# EAGLE design 12db-Xover (EAGLE 7.6.0)
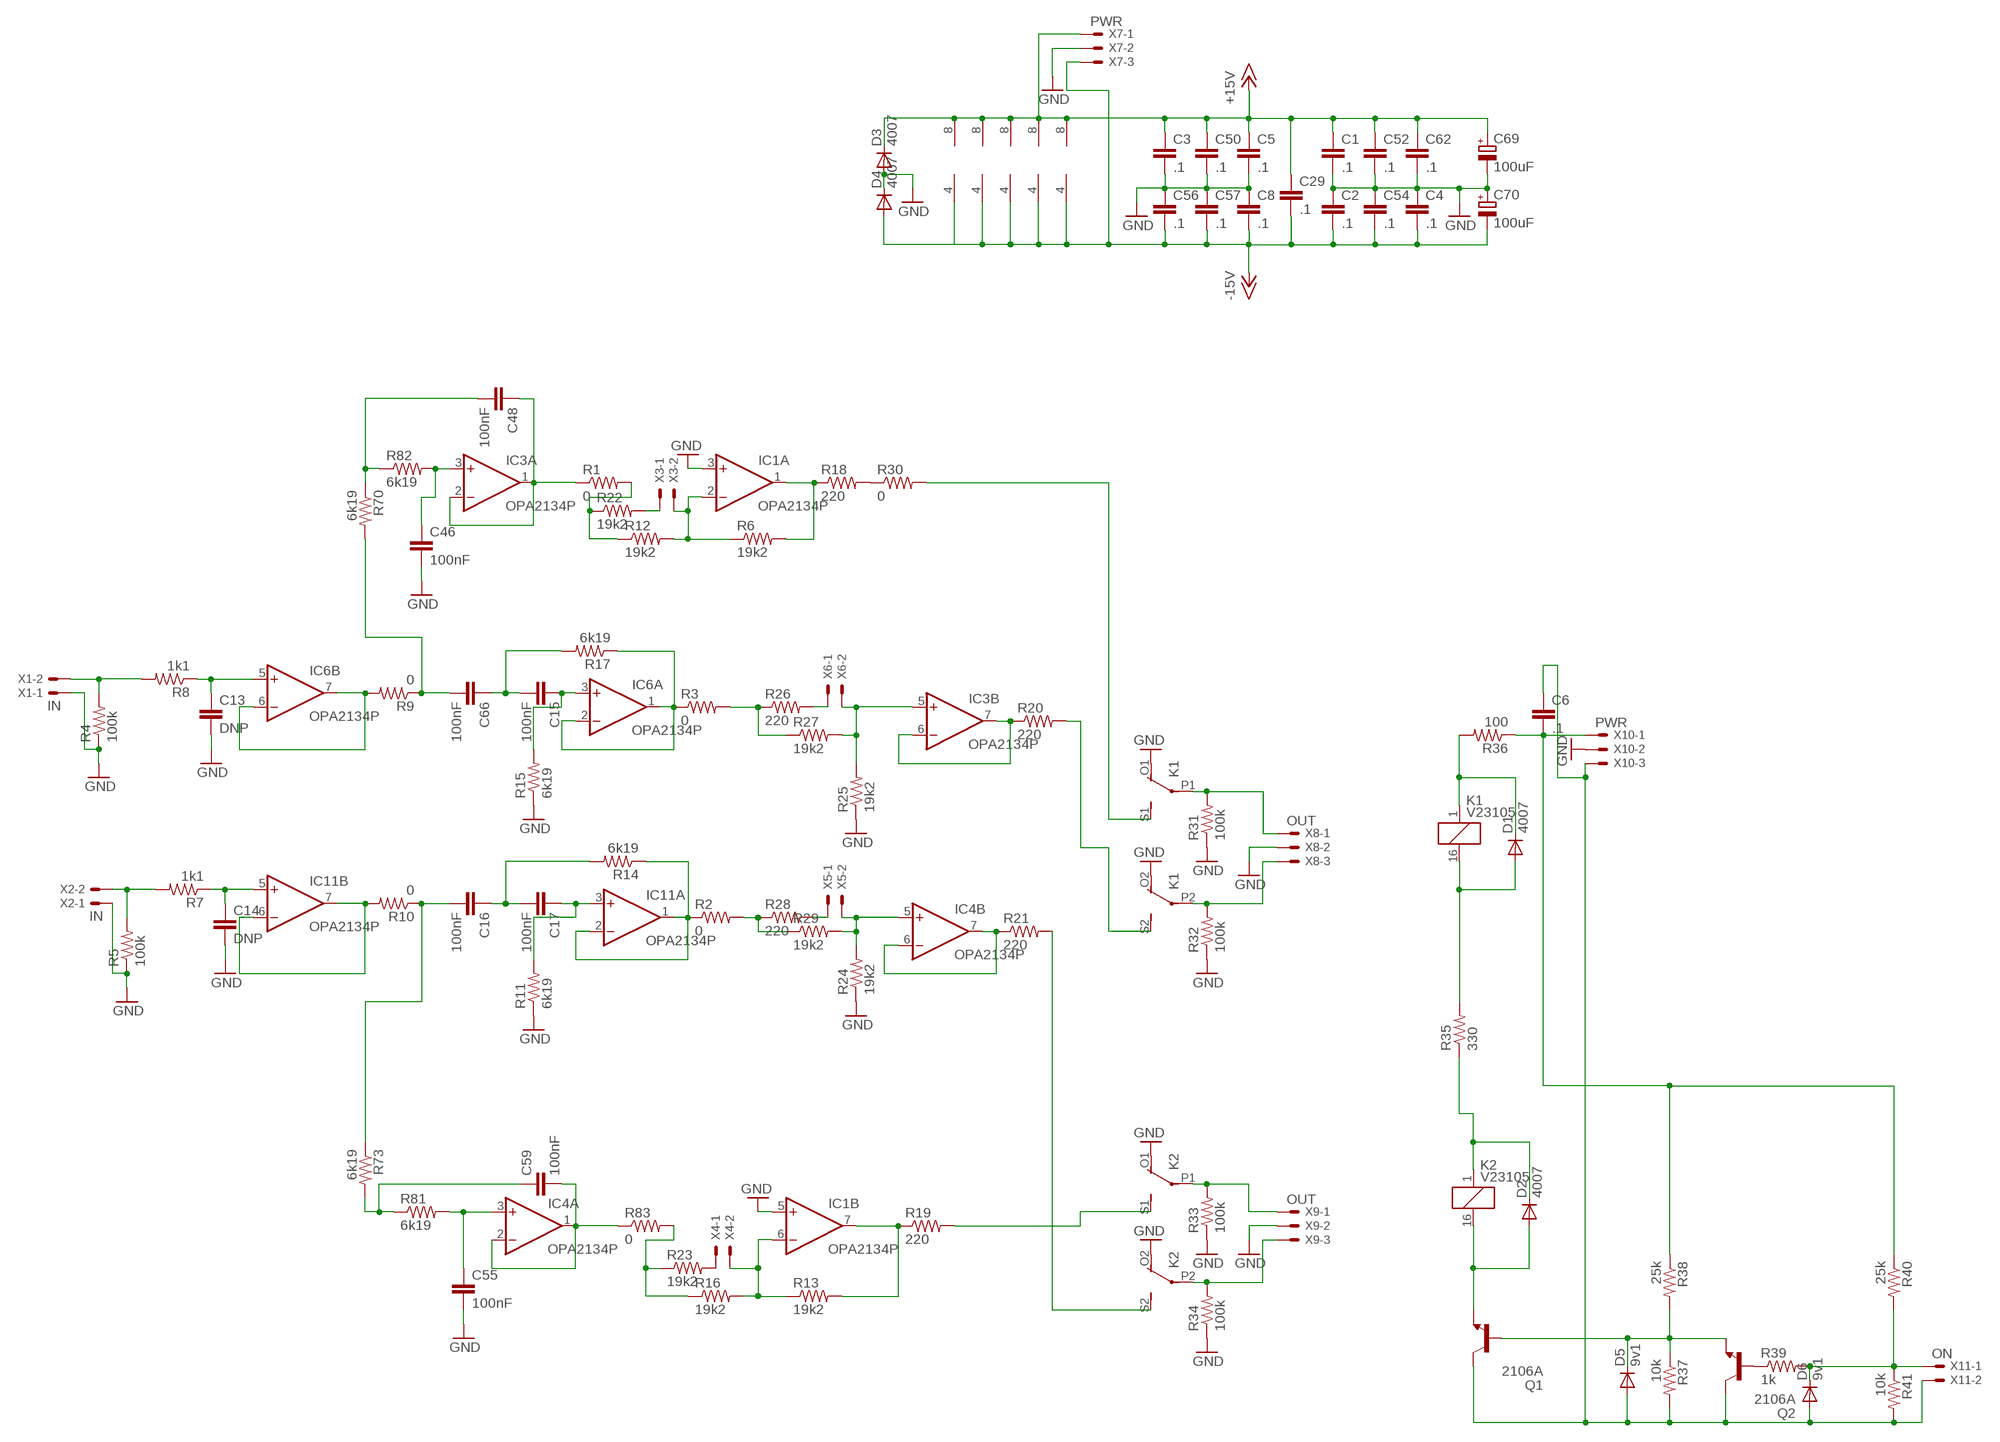
[diagram p0: schematic, sheet 1]

## Parts
C1  .1  C-EUC4532  [C4532]
C2  .1  C-EUC4532  [C4532]
C3  .1  C-EUC4532  [C4532]
C4  .1  C-EUC4532  [C4532]
C5  .1  C-EUC4532  [C4532]
C6  .1  C-EUC4532  [C4532]
C8  .1  C-EUC4532  [C4532]
C13  DNP  C-EU050-035X075  [C050-035X075]
C14  DNP  C-EU050-035X075  [C050-035X075]
C15  100nF  C-EU050-075X075  [C050-075X075]
C16  100nF  C-EU050-075X075  [C050-075X075]
C17  100nF  C-EU050-075X075  [C050-075X075]
C29  .1  C-EUC4532  [C4532]
C46  100nF  C-EU050-075X075  [C050-075X075]
C48  100nF  C-EU050-075X075  [C050-075X075]
C50  .1  C-EUC4532  [C4532]
C52  .1  C-EUC4532  [C4532]
C54  .1  C-EUC4532  [C4532]
C55  100nF  C-EU050-075X075  [C050-075X075]
C56  .1  C-EUC4532  [C4532]
C57  .1  C-EUC4532  [C4532]
C59  100nF  C-EU050-075X075  [C050-075X075]
C62  .1  C-EUC4532  [C4532]
C66  100nF  C-EU050-075X075  [C050-075X075]
C69  100uF  CPOL-EUE3.5-10  [E3,5-10]
C70  100uF  CPOL-EUE3.5-10  [E3,5-10]
D1  4007  1N4148DO35-10  [DO35-10]
D2  4007  1N4148DO35-10  [DO35-10]
D3  4007  1N4148DO35-10  [DO35-10]
D4  4007  1N4148DO35-10  [DO35-10]
D5  9v1  1N4148DO35-7  [DO35-7]
D6  9v1  1N4148DO35-7  [DO35-7]
IC1  OPA2134P  [DIL08]
IC3  OPA2134P  [DIL08]
IC4  OPA2134P  [DIL08]
IC6  OPA2134P  [DIL08]
IC11  OPA2134P  [DIL08]
K1  V23105  351  [351]
K2  V23105  351  [351]
Q1  2106A  BC546B  [TO92-EBC]
Q2  2106A  BC546B  [TO92-EBC]
R1  0  R-US_0309/12  [0309/12]
R2  0  R-US_0309/10  [0309/10]
R3  0  R-US_0309/12  [0309/12]
R4  100k  R-US_0309/10  [0309/10]
R5  100k  R-US_0309/10  [0309/10]
R6  19k2  R-US_0309/10  [0309/10]
R7  1k1  R-US_0309/10  [0309/10]
R8  1k1  R-US_0309/10  [0309/10]
R9  0  R-US_0309/10  [0309/10]
R10  0  R-US_0309/10  [0309/10]
R11  6k19  R-US_0309/12  [0309/12]
R12  19k2  R-US_0309/10  [0309/10]
R13  19k2  R-US_0309/10  [0309/10]
R14  6k19  R-US_0309/10  [0309/10]
R15  6k19  R-US_0309/12  [0309/12]
R16  19k2  R-US_0309/10  [0309/10]
R17  6k19  R-US_0309/10  [0309/10]
R18  220  R-US_0309/12  [0309/12]
R19  220  R-US_0309/10  [0309/10]
R20  220  R-US_0309/12  [0309/12]
R21  220  R-US_0309/10  [0309/10]
R22  19k2  R-US_0309/10  [0309/10]
R23  19k2  R-US_0309/10  [0309/10]
R24  19k2  R-US_0309/12  [0309/12]
R25  19k2  R-US_0309/12  [0309/12]
R26  220  R-US_0309/10  [0309/10]
R27  19k2  R-US_0309/10  [0309/10]
R28  220  R-US_0309/10  [0309/10]
R29  19k2  R-US_0309/10  [0309/10]
R30  0  R-US_0309/10  [0309/10]
R31  100k  R-US_0309/10  [0309/10]
R32  100k  R-US_0309/10  [0309/10]
R33  100k  R-US_0309/10  [0309/10]
R34  100k  R-US_0309/10  [0309/10]
R35  330  R-US_0411/15  [0411/15]
R36  100  R-US_0309/12  [0309/12]
R37  10k  R-US_0309/12  [0309/12]
R38  25k  R-US_0309/10  [0309/10]
R39  1k  R-US_0309/10  [0309/10]
R40  25k  R-US_0309/10  [0309/10]
R41  10k  R-US_0309/12  [0309/12]
R70  6k19  R-US_0309/12  [0309/12]
R73  6k19  R-US_0309/12  [0309/12]
R81  6k19  R-US_0309/12  [0309/12]
R82  6k19  R-US_0309/12  [0309/12]
R83  0  R-US_0309/10  [0309/10]
X1  IN  22-23-2021  [22-23-2021]
X2  IN  22-23-2021  [22-23-2021]
X3  22-23-2021  [22-23-2021]
X4  22-23-2021  [22-23-2021]
X5  22-23-2021  [22-23-2021]
X6  22-23-2021  [22-23-2021]
X7  PWR  22-23-2031  [22-23-2031]
X8  OUT  22-23-2031  [22-23-2031]
X9  OUT  22-23-2031  [22-23-2031]
X10  PWR  22-23-2031  [22-23-2031]
X11  ON  22-23-2021  [22-23-2021]

## Nets
+15V: C1.1 C3.1 C5.1 C29.1 C50.1 C52.1 C62.1 C69.+ D3.C IC1.8(P:V+) IC3.8(P:V+) IC4.8(P:V+) IC6.8(P:V+) IC11.8(P:V+) X7.1
-15V: C2.2 C4.2 C8.2 C29.2 C54.2 C56.2 C57.2 C70.- D4.A IC1.4(P:V-) IC3.4(P:V-) IC4.4(P:V-) IC6.4(P:V-) IC11.4(P:V-) X7.3
GND: C1.2 C2.1 C3.2 C4.1 C5.2 C8.1 C13.2 C14.2 C46.2 C50.2 C52.2 C54.1 C55.2 C56.1 C57.1 C62.2 C69.- C70.+ D3.A D4.C IC1.3(A:+IN) IC1.5(B:+IN) K1.O1(2:O) K1.O2(3:O) K2.O1(2:O) K2.O2(3:O) R4.1 R5.1 R11.1 R15.1 R24.1 R25.1 R31.1 R32.1 R33.1 R34.1 X1.1 X2.1 X7.2 X8.2 X9.2 X10.2
N$1: IC6.1(A:OUT) IC6.2(A:-IN) R3.1 R17.1
N$2: IC3.5(B:+IN) R25.2 R27.2 X6.2
N$3: IC11.6(B:-IN) IC11.7(B:OUT) R10.2
N$4: IC4.5(B:+IN) R24.2 R29.2 X5.2
N$5: C14.1 IC11.5(B:+IN) R7.1
N$6: R5.2 R7.2 X2.2
N$7: R4.2 R8.2 X1.2
N$8: C13.1 IC6.5(B:+IN) R8.1
N$9: IC6.6(B:-IN) IC6.7(B:OUT) R9.2
N$10: IC1.2(A:-IN) R6.1 R12.2 X3.2
N$11: IC1.6(B:-IN) R13.1 R16.2 X4.2
N$12: C15.1 IC6.3(A:+IN) R15.2
N$13: C15.2 C66.1 R17.2
N$14: IC1.1(A:OUT) R6.2 R18.1
N$15: C16.1 C17.2 R14.2
N$16: C17.1 IC11.3(A:+IN) R11.2
N$17: IC3.6(B:-IN) IC3.7(B:OUT) R20.1
N$18: IC4.6(B:-IN) IC4.7(B:OUT) R21.1
N$19: IC1.7(B:OUT) R13.2 R19.1
N$20: R22.2 X3.1
N$21: R1.2 R12.1 R22.1
N$22: R16.1 R23.1 R83.2
N$23: R23.2 X4.1
N$24: R26.2 X6.1
N$25: R28.2 X5.1
N$26: R3.2 R26.1 R27.1
N$27: R2.2 R28.1 R29.1
N$28: IC11.1(A:OUT) IC11.2(A:-IN) R2.1 R14.1
N$29: R18.2 R30.1
N$30: K2.P2(3:P) R34.2 X9.3
N$31: K2.P1(2:P) R33.2 X9.1
N$32: K1.P2(3:P) R32.2 X8.3
N$33: K1.P1(2:P) R31.2 X8.1
N$34: K1.S1(2:S) R30.2
N$35: K1.S2(3:S) R20.2
N$36: K2.S1(2:S) R19.2
N$37: K2.S2(3:S) R21.2
N$38: D2.C K2.1 R35.1
N$39: D1.A K1.16 R35.2
N$40: D1.C K1.1 R36.2
N$41: D2.A K2.16 Q1.E
N$42: C6.2 R36.1 R38.1 R40.1 X10.1
N$43: C6.1 D5.A D6.A Q1.C Q2.C R37.2 R41.2 X10.3 X11.2
N$44: D5.C Q1.B Q2.E R37.1 R38.2
N$45: Q2.B R39.1
N$46: D6.C R39.2 R40.2 R41.1 X11.1
N$76: C66.2 R9.1 R70.2
N$85: C59.2 IC4.1(A:OUT) IC4.2(A:-IN) R83.1
N$86: C48.1 IC3.1(A:OUT) IC3.2(A:-IN) R1.1
N$89: C46.1 IC3.3(A:+IN) R82.2
N$90: C48.2 R70.1 R82.1
N$91: C59.1 R73.2 R81.1
N$92: C55.1 IC4.3(A:+IN) R81.2
N$102: C16.2 R10.1 R73.1

## Library data of the parts
C1-C6 C8 C13-C17 C29 C46 C48 C50 C52 C54-C57 C59 C62 C66 = resistor:C-EU: CAPACITOR, European symbol
C69 C70 = resistor:CPOL-EU: POLARIZED CAPACITOR, European symbol
D1-D6 = diode:1N4148: DIODE high speed (Philips)
IC1 IC3 IC4 IC6 IC11 = linear:OPA2134: SoundPLUS (TM) High Performance AUDIO OPERATIONAL AMPLIFIERS Source: http://focus.ti.com/lit/ds/sbos058/sbos058.pdf
K1 K2 = relay:351: RELAY 2 x switch, Omron; OC_FARNELL: unknown; OC_NEWARK: unknown
Q1 Q2 = transistor-npn:BC546*: NPN Transistor
R1-R41 R70 R73 R81-R83 = resistor:R-US_: RESISTOR, American symbol
X1-X6 X11 = con-molex:22-23-2021: .100" (2.54mm) Center Header - 2 Pin; MF: MOLEX; MPN: 22-23-2021; OC_FARNELL: 1462926; OC_NEWARK: 25C3832
X7-X10 = con-molex:22-23-2031: .100" (2.54mm) Center Header - 3 Pin; MF: MOLEX; MPN: 22-23-2031; OC_FARNELL: 1462950; OC_NEWARK: 30C0862

## Board
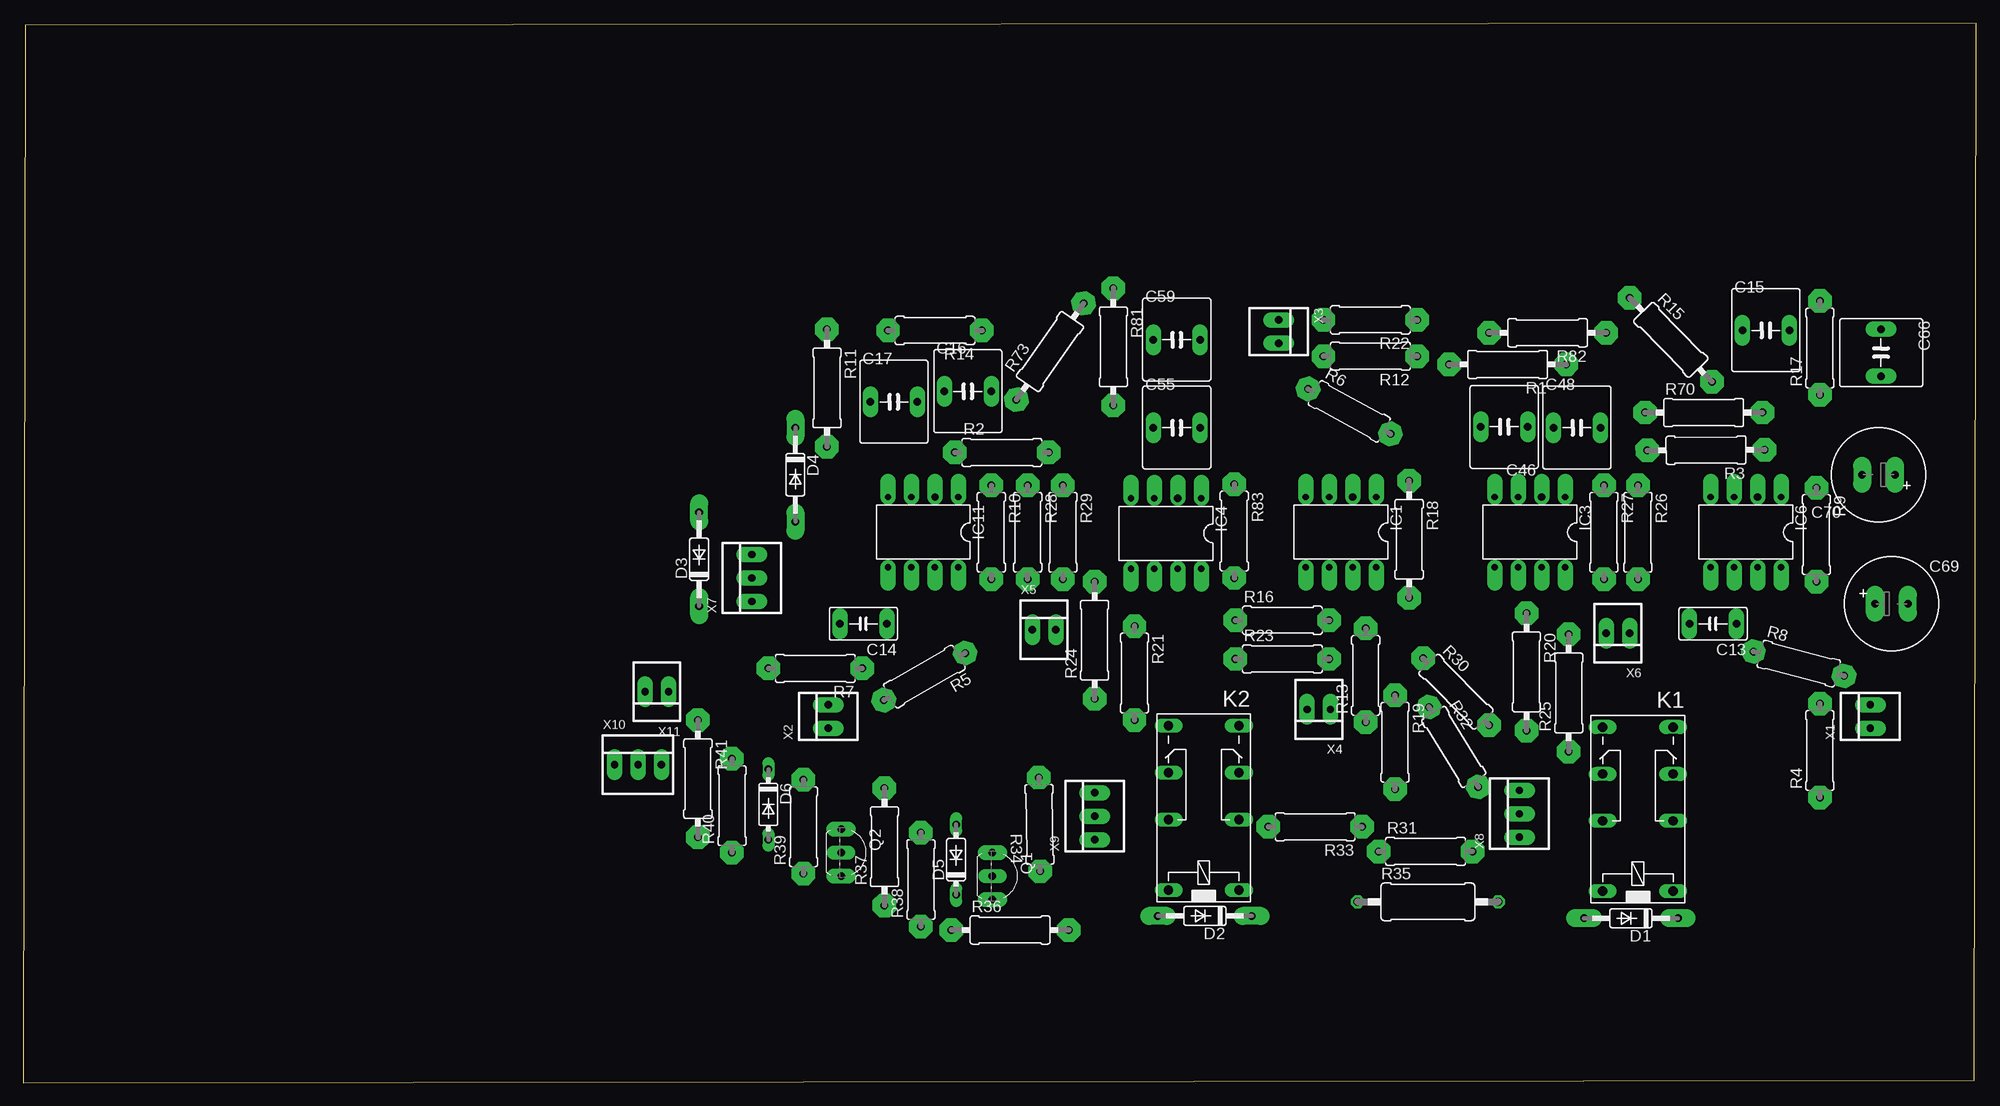
[diagram p1: board, top side]
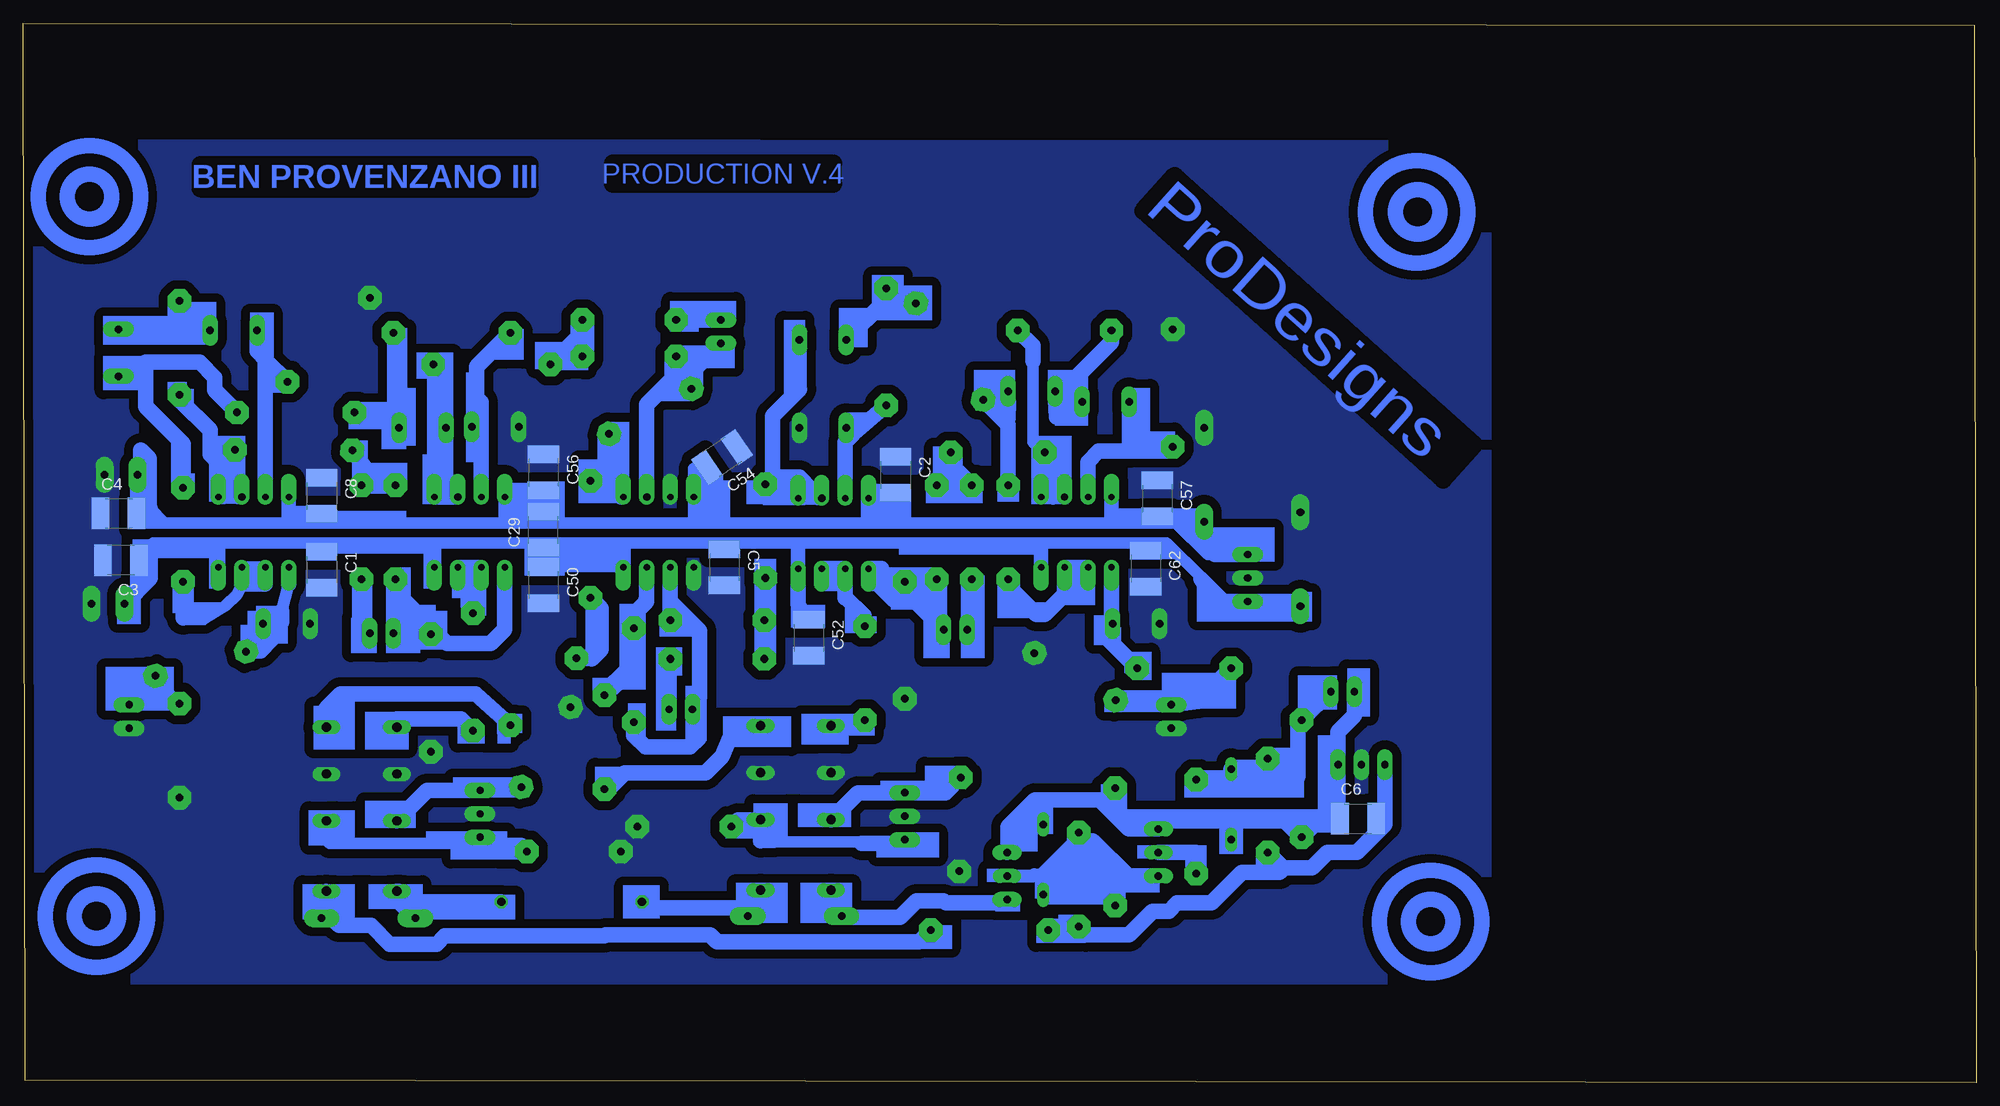
[diagram p2: board, bottom side, seen from below]

Size 211.38 x 114.67 mm. Coordinates in mm from the lower left corner, seen from the top.
Outline: 0,0 211.12,0.25 211.38,114.67 0.25,114.42 0,0
Copper layers (1*16): Top 0.035mm / dielectric 1.5mm / Bottom 0.035mm
Design rules "default": minimum track width 10mil, minimum drill 24mil, track to track 8mil, track to pad 8mil, pad to pad 8mil, via to via 8mil, smd to smd 8mil, copper to edge 40mil, drill to drill 8mil, minimum pad ring 10mil, minimum via ring 8mil, stop-mask expansion 5mil, vias tented up to drill 0mil, thermal gap 10mil

### Footprints (pad centres in the part's own frame; a part is rotated, then mirrored left to right if it is on the bottom)
C4532 = smd 1.9 x 3.4: 1 -1.95,0; 2 1.95,0
C050-035X075 = drill 0.813 pad 1.676 long: 1 -2.54,0; 2 2.54,0
C050-075X075 = drill 0.813 pad 1.676 long: 1 -2.54,0; 2 2.54,0
E3,5-10 = drill 0.813 pad 1.93 long: + -1.778,0; - 1.778,0
DO35-10 = drill 0.813 pad 1.93 long: A 5.08,0; C -5.08,0
DO35-7 = drill 0.813 long: A 3.81,0; C -3.81,0
DIL08 = drill 0.7 pad 1.676 offset: 1 -3.81,-3.81; 3 1.27,-3.81; 4 3.81,-3.81; 5 3.81,3.81; 6 1.27,3.81; 7 -1.27,3.81; 8 -3.81,3.81 | drill 0.8 pad 1.676 offset: 2 -1.27,-3.81
351 = drill 1.016 long: 1 -3.81,-3.81; 16 -3.81,3.81; O1 8.89,-3.81; O2 8.89,3.81; P1 3.81,-3.81; P2 3.81,3.81; S1 13.97,-3.81; S2 13.97,3.81
TO92-EBC = drill 0.813 pad 1.524 long: B 0,-1.27 | drill 0.813 pad 1.6 long: C -2.54,-1.27; E 2.54,-1.27
0309/12 = drill 0.813 pad 2.54 octagon: 1 -6.35,0; 2 6.35,0
0309/10 = drill 0.813 pad 2.54 octagon: 1 -5.08,0; 2 5.08,0
0411/15 = drill 0.914 octagon: 1 -7.62,0; 2 7.62,0
22-23-2021 = drill 0.8 pad 1.676 long: 1 -1.27,0; 2 1.27,0
22-23-2031 = drill 0.8 pad 1.676 long: 1 -2.54,0; 2 0,0; 3 2.54,0

### Placement (x,y rotation side)
C1  179.07,55.5 270 bottom
C2  116.97,65.79 270 bottom
C3  200.79,56.52 180 bottom
C4  201.04,61.59 0 bottom
C5  135.51,55.75 270.2 bottom
C6  66.93,28.57 0 bottom
C8  179.07,63.5 270 bottom
C13  182.88,49.66 180 top
C14  90.93,49.66 180 top
C15  188.59,81.41 0 top
C16  102.23,74.8 0 top
C17  94.23,73.66 0 top
C29  155.07,59.82 90 bottom
C46  160.27,70.99 180 top
C48  168.15,70.87 0 top
C50  155.07,53.85 270 bottom
C52  126.37,48.13 270 bottom
C54  135.76,67.69 214.4 bottom
C55  124.84,70.87 0 top
C56  155.07,66.04 270 bottom
C57  88.65,63.25 270 bottom
C59  124.84,80.39 0 top
C62  89.92,55.63 270 bottom
C66  201.04,78.99 270 top
C69  202.18,51.82 0 top
C70  200.79,65.79 180 top
D1  173.99,17.78 180 top
D2  127.89,18.03 180 top
D3  73.15,56.64 90 top
D4  83.57,65.79 270 top
D5  100.97,24.13 90 top
D6  80.64,30.1 270 top
IC1  142.62,59.56 180 top
IC3  163.07,59.56 180 top
IC4  123.7,59.44 180 top
IC6  186.44,59.56 180 top
IC11  97.41,59.56 180 top
K1  174.75,24.51 90 top
K2  127.76,24.64 90 top
Q1  106.17,22.35 270 top
Q2  89.79,24.89 270 top
R1  160.66,77.72 180 top
R2  105.92,68.2 0 top
R3  182.12,68.45 180.3 top
R4  194.44,35.94 90 top
R5  97.54,43.94 210.1 top
R6  143.51,72.64 331.3 top
R7  85.72,44.83 180 top
R8  192.15,45.34 345 top
R9  194.06,59.31 270 top
R10  104.78,59.56 270 top
R11  87,75.18 270 top
R12  145.8,78.61 180 top
R13  145.29,44.07 90 top
R14  98.68,81.41 180 top
R15  178.31,80.39 314.5 top
R16  136.27,50.04 0 top
R17  194.44,79.5 90 top
R18  149.99,58.8 270 top
R19  148.46,36.83 270 top
R20  162.69,44.45 270 top
R21  120.27,44.32 270 top
R22  145.8,82.55 180 top
R23  136.27,45.85 0 top
R24  115.95,47.88 90 top
R25  167.26,42.16 90 top
R26  174.75,59.56 270 top
R27  171.07,59.56 270 top
R28  108.71,59.56 270 top
R29  112.52,59.56 270 top
R30  155.07,42.29 314.6 top
R31  151.76,25.02 0 top
R32  154.81,36.32 301.6 top
R33  139.83,27.69 180 top
R34  109.98,27.94 90.8 top
R35  152.02,19.56 0 top
R36  106.81,16.51 0 top
R37  93.22,25.53 90 top
R38  97.16,21.97 90 top
R39  84.46,27.69 90 top
R40  76.71,29.97 90 top
R41  73.03,32.89 270 top
R70  181.86,72.52 0 top
R73  111.12,79.12 55.1 top
R81  117.98,79.63 270 top
R82  164.97,81.15 180 top
R83  131.06,59.69 270 top
X1  199.9,39.62 90 top
X2  87.12,39.62 90 top
X3  135.89,81.28 270 top
X4  140.21,40.39 180 top
X5  110.49,49.02 0 top
X6  172.59,48.64 180 top
X7  78.87,54.61 90 top
X8  161.92,29.08 90 top
X9  115.95,28.83 90 top
X10  66.55,34.42 0 top
X11  68.58,42.29 180 top

### Tracks (layer width: path | path; a pad name or v marks a point on that pad's centre or on a via)
+15V
  Bottom 0.406: IC6.8 190.25,58.42
  Bottom 1.016: IC3.8 166.88,58.29 | 87.29,57.58 88.01,57.78 88.01,58.42 | IC11.8 101.22,58.29
  Bottom 1.27: 127.63,58.42 135.13,58.42 | 135.13,58.42 146.43,58.42 | 146.43,58.42 167,58.42 | 167,58.42 179.07,58.42 | 179.07,58.42 190.25,58.42 197.28,58.42 197.89,57.66 | 166.88,58.29 167,58.42 | 127.63,58.42 127.51,58.29 IC4.8 | 101.22,58.29 101.09,58.42 | 127.63,58.42 101.09,58.42 | 101.09,58.42 88.01,58.42 87.63,58.42 83.82,54.61 83.8,54.35 | 146.43,57.78 146.43,58.42 | C5.1 135.13,58.09 135.13,58.42 | C1.1 179.07,58.42
  Bottom 1.676: C52.1 127.51,51.73 IC4.8 | 87.29,57.58 C62.1 | 197.61,57.28 197.89,57.56 197.89,57.66 | 197.61,57.28 197.61,54.61 C69.+ 200.03,51.82 199.64,51.44 | C50.1 C29.1 148.29,57.87 IC1.8 146.43,57.78 | 197.61,57.28 197.82,57.28 C3.1 | 83.94,54.48 83.8,54.35 81.53,52.07 X7.1 73.66,52.07 D3.C
-15V
  Bottom 0.406: 182.63,63.25 182.55,61.57 182.5,60.58
  Bottom 1.016: IC11.4 93.6,60.71
  Bottom 1.27: 88.65,60.58 86.61,60.58 83.19,57.15 82.42,57.15 81.91,57.15 | 88.65,60.58 93.47,60.58 | 93.47,60.58 118.36,60.58 | 118.36,60.58 138.81,60.58 | 138.81,60.58 159.13,60.58 | 159.13,60.58 182.5,60.58 196.09,60.58 197.61,62.1 | 159.26,60.71 159.13,60.58 | 93.6,60.71 93.47,60.58 | C57.2 88.65,60.58 | 118.36,60.58 118.24,60.71 118.24,61.47 | 138.81,60.58 IC1.4 138.81,66.47 C54.2
  Bottom 1.422: C70.- 197.61,66.42 197.61,62.1 | IC3.4 159.26,60.71
  Bottom 1.676: IC4.4 119.89,62.61 | 119.89,62.61 119.89,61.21 118.92,62.19 C2.2 | 182.63,63.25 IC6.4 182.63,64.52 | 197.61,62.1 199.09,62.1 C4.2 | C56.2 C29.2 155.07,61.72 155.57,61.21 156.84,61.21 IC3.4 | 179.07,61.59 C8.2 179.09,61.57 182.55,61.57 | C70.- 197.87,65.79 197.74,65.91 197.74,67.56 198.63,68.45 198.63,66.17 C70.- | C70.- 199.01,65.66 | D4.A 83.57,58.29 82.42,57.15 X7.3 | 118.24,61.47 118.75,61.47 119.89,62.61
GND
  pour Bottom (isolate 0.965, no thermals): 53.21,101.35 53.21,11.3 209.93,11.3 210.06,101.47
N$1
  Bottom 1.676: IC6.2 188.85,63.5 | 188.85,63.5 IC6.1 | 190.31,67.12 191.13,67.94 191.13,70.61 194.31,73.79 R17.1 | 190.31,67.12 188.85,65.66 188.85,63.5 | R3.1 190.31,67.65 190.31,67.12
N$2
  Bottom 1.676: IC3.5 159.26,49.02 160.78,47.5 165.48,47.5 168.02,50.04 | 168.02,50.04 168.47,50.48 | 168.47,50.48 171.07,53.09 R27.2 | X6.2 169.48,50.48 168.47,50.48 | R25.2 167.64,50.04 168.02,50.04
N$3
  Bottom 1.676: R10.2 104.78,53.72 101.73,50.67 100.84,50.67 98.68,52.83 IC11.7 IC11.6
N$4
  Bottom 1.676: 118.49,55.63 118.75,55.63 | 118.75,55.63 IC4.5 | R24.2 114.94,52.2 | 114.94,52.2 112.65,54.48 R29.2 | X5.2 114.94,52.2 | 114.94,52.2 117.09,52.2 118.75,53.85 118.75,55.63
N$5
  Bottom 1.676: IC11.5 93.6,50.67 C14.1 93.6,49.66 94.23,49.02 94.23,48.26 R7.1
N$6
  Bottom 1.676: R7.2 84.2,41.27 X2.2 90.68,41.27 90.8,41.39 R5.2
N$7
  Bottom 1.676: R8.2 197.23,44.2 199.01,44.2 | 199.01,44.2 R4.2 | X1.2 199.01,41.78 199.01,44.2
N$8
  Bottom 1.27: 182.63,53.98 183.39,51.05
  Bottom 1.676: IC6.5 182.63,53.98 | 184.53,49.28 184.7,49.19 184.96,49.19 C13.1 | 184.53,49.28 183.39,49.88 183.39,51.05 | R8.1 187.16,46.74 185.67,46.74 184.53,47.88 184.53,49.28
N$9
  Bottom 1.016: 191.77,50.16 193.93,50.16 194.06,50.29
  Bottom 1.27: IC6.6 185.17,53.98 | IC6.7 187.71,55.37 187.71,53.85 188.21,52.83 189.48,51.56 191.77,50.16
  Bottom 1.676: R9.2 194.06,50.29 | 185.17,53.98 187.71,53.98 187.71,55.37
N$10
  Bottom 1.676: X3.2 138.75,77.15 | 138.75,77.15 139.13,76.77 | R12.2 139.13,77.03 139.13,76.77 | IC1.2 143.89,73.41 140.15,77.15 138.75,77.15 | 139.89,76.77 139.13,76.77 | R6.1 139.13,75.92 139.13,76.77
N$11
  Bottom 1.676: IC1.6 141.35,52.07 | R16.2 141.35,52.07 | 141.35,52.07 138.18,48.9 138.18,41.66 138.94,40.89 X4.2 138.3,39.75 138.3,37.21 139.19,36.32 144.02,36.32 145.29,37.59 R13.1
N$12
  Bottom 1.676: C15.1 186.05,79.16 185.17,78.27 | 185.17,78.27 R15.2 | IC6.3 185.17,78.27
N$13
  Bottom 1.676: C66.1 195.83,81.53 194.18,83.57 | 194.18,83.57 C15.2 | R17.2 194.18,84.58 194.18,83.57
N$14
  Bottom 1.676: 147.32,66.8 147.32,64.01 146.69,63.37 IC1.1 | R18.1 147.32,66.8 | R6.2 147.32,69.56 147.32,66.8
N$15
  Bottom 1.676: 97.92,73.66 98.3,74.04 98.3,75.44 93.6,80.14 R14.2 | 97.92,73.66 C17.2 | C16.1 99.57,72.01 97.92,73.66
N$16
  Bottom 1.676: 91.57,68.83 91.57,68.33 95,68.33 96.14,67.18 IC11.3 | 91.57,68.83 C17.1 | R11.2 91.57,68.83
N$17
  Bottom 1.676: IC3.6 163.19,55.75 | 163.19,55.75 IC3.7 | R20.1 163.19,51.56 163.19,55.75
N$18
  Bottom 1.676: IC4.7 IC4.6 122.43,52.45 122.3,52.45 120.4,50.55 R21.1
N$19
  Bottom 1.676: IC1.7 143.89,52.2 | 143.89,52.2 143.89,52.07 145.29,50.67 R13.2 145.29,44.77 145.86,44.77 145.92,44.83 | 144.02,52.2 143.89,52.2 | R19.1 145.92,44.2 145.92,44.83 | 145.92,44.83 148.59,42.16 148.59,41.66
N$20
  Bottom 1.676: X3.1 R22.2
N$21
  Bottom 1.676: R22.1 150.88,80.39 | 150.88,80.39 R12.1 | R1.2 151.64,80.39 150.88,80.39
N$22
  Bottom 1.676: R23.1 131.06,45.97 131.06,49.91 | 131.06,49.91 R83.2 | R16.1 131.06,49.91
N$23
  Bottom 1.676: R23.2 141.48,45.72 X4.1
N$24
  Bottom 1.676: X6.1 174.75,49.66 R26.2
N$25
  Bottom 1.676: X5.1 108.71,49.53 R28.2
N$26
  Bottom 1.676: R27.1 172.21,65.53 174.24,65.53 | 174.24,65.53 175.13,64.64 R26.1 | R3.2 174.24,66.39 174.24,65.53
N$27
  Bottom 1.676: R28.1 110.81,66.74 | 110.81,66.74 111,66.93 R2.2 | R29.1 110.81,66.36 110.81,66.74
N$28
  Bottom 1.27: 102.11,78.11 102.11,69.34 99.95,67.18 | IC11.1 IC11.2 98.81,63.5 99.82,63.5
  Bottom 1.676: 99.82,63.5 99.95,63.37 99.95,67.18 100.84,68.07 R2.1 | R14.1 102.11,79.76 102.11,78.11
N$29
  Bottom 1.676: R18.2 148.84,51.31 148.84,46.86 149.86,45.85 R30.1
N$30
  Bottom 1.676: K2.P2 121.03,31.37 X9.3 111.56,31.37 R34.2
N$31
  Bottom 1.27: 120.65,25.91 120.78,26.04 130.05,26.04 130.11,25.97 131.38,25.97 131.57,26.16
  Bottom 1.676: X9.1 116.59,25.65 116.84,25.91 120.65,25.91 | 131.57,26.16 K2.P1 133.98,28.45 R33.2
N$32
  Bottom 1.676: K1.P2 167.64,31.62 X8.3 161.55,32 R32.2
N$33
  Bottom 1.27: 162.81,25.65 163.07,25.91 178.18,25.91 178.56,26.29 178.56,27.05
  Bottom 1.676: X8.1 162.81,25.65 157.48,25.65 R31.2 | 178.56,27.05 K1.P1
N$34
  Bottom 1.676: R30.2 159.26,37.9 159.26,39.24 162.43,42.04 177.04,42.04 178.56,40.51 K1.S1
N$35
  Bottom 1.676: R20.2 163.96,39.37 170.94,39.37 K1.S2
N$36
  Bottom 1.676: K2.S1 133.73,38.61 134.87,37.34 135.76,35.31 137.54,33.53 146.3,33.53 148.08,31.75 R19.2
N$37
  Bottom 1.676: R21.2 121.92,38.61 K2.S2
N$38
  Bottom 1.676: D2.C 132.97,19.43 K2.1 133.48,18.92 143.64,18.92 144.27,19.56 R35.1
N$39
  Bottom 1.676: R35.2 169.54,19.56 170.69,20.7 K1.16 170.94,19.81 D1.A
N$40
  Bottom 1.676: K1.1 178.56,18.29 D1.C 177.93,17.78 177.16,17.02 173.74,17.02 171.7,14.99 166.62,14.99 165.73,15.88 148.46,15.88 148.34,16 137.03,16 136.27,15.24 114.43,15.24 R36.2
N$41
  Bottom 1.676: K2.16 122.81,19.69 D2.A 122.43,18.03 122.3,17.91 116.46,17.91 114.68,19.69 111.76,19.69 111.51,19.43 105.28,19.43 Q1.E
N$42
  Bottom 1.676: C6.2 64.01,29.55 | 64.01,29.55 X10.1 | R36.1 100.08,16.89 R38.1 96.27,16 91.69,16 89.15,18.54 87.38,18.54 86.49,19.43 82.8,19.43 79.5,22.73 75.44,22.73 75.06,23.11 | 75.06,23.11 74.93,23.24 71.88,23.24 70.23,24.89 67.06,24.89 64.01,27.94 64.01,29.55 | R40.1 75.06,23.24 75.06,23.11
N$43
  Bottom 1.676: Q1.C 104.78,25.02 104.78,27.69 101.85,30.61 101.09,30.61 | 101.09,30.61 94.87,30.61 | 94.87,30.61 94.62,30.61 94.49,30.48 | R37.2 93.09,31.75 93.09,30.48 93.22,30.35 93.22,28.96 | D5.A 101.09,28.07 101.09,30.61 | Q2.C 90.93,27.43 | 90.93,27.43 91.69,27.43 93.22,28.96 | 93.22,28.96 94.87,30.61 | 90.93,27.43 90.93,28.07 91.19,28.32 81.41,28.32 | 81.41,28.32 80.64,27.56 D6.A | 81.41,28.32 74.8,28.32 R41.2 71.69,27.88 | 71.69,27.88 69.09,30.48 X10.3 69.09,37.97 67.31,39.75 X11.2 | C6.1 69.58,27.88 71.69,27.88
N$44
  Bottom 1.422: Q1.B 102.11,22.35 101.98,22.48 100.97,22.48
  Bottom 1.676: 100.97,22.48 100.71,22.73 | 100.71,22.73 97.28,26.16 | 97.28,26.16 96.9,26.54 R38.2 | D5.C 100.71,20.57 100.71,22.23 | 100.71,22.23 100.71,22.73 | R37.1 96.27,22.23 100.71,22.23 | Q2.E 91.82,22.35 95.63,26.16 97.28,26.16
N$45
  Bottom 1.676: Q2.B 84.46,24.89 R39.1
N$46
  Bottom 1.676: R39.2 83.95,32.26 78.1,32.26 | 78.1,32.26 77.09,33.27 80.01,33.27 D6.C | 78.1,32.26 74.55,32.26 | 74.55,32.26 74.3,32.26 73.41,33.15 73.41,38.86 R41.1 69.98,42.29 X11.1 | R40.2 74.55,32.89 74.55,32.26
N$76
  Bottom 1.676: R9.1 194.06,69.09 198.12,73.15 198.12,77.98 | 198.12,77.98 199.64,76.45 C66.2 | R70.2 190.63,74.93 190.63,76.33 192.28,77.98 198.12,77.98
N$85
  Bottom 1.27: C59.2 127.38,75.06
  Bottom 1.676: IC4.1 126.11,63.37 | 126.11,63.37 IC4.2 | R83.1 130.3,65.53 | 130.3,65.53 127.38,65.53 126.11,64.26 126.11,63.37 | 127.38,75.06 130.3,72.14 130.3,65.53
N$86
  Bottom 1.676: IC3.1 165.35,63.37 | 165.35,63.37 IC3.2 | 165.35,63.37 165.35,64.01 166.62,65.28 166.62,72.52 | R1.1 166.62,75.69 166.62,72.52 | C48.1 166.37,72.52 166.62,72.52
N$89
  Bottom 1.676: IC3.3 161.8,70.74 | C46.1 162.31,70.99 | 162.31,70.99 162.05,70.99 161.8,70.74 | 161.8,70.74 161.8,73.66 162.31,74.17 | R82.2 162.31,77.47 162.31,74.17 | 162.31,74.17 162.31,70.99
N$90
  Bottom 1.676: R82.1 170.69,80.52 170.69,72.64 | 170.69,72.64 C48.2 | R70.1 175.39,72.64 170.69,72.64
N$91
  Bottom 1.676: C59.1 118.17,84.52 117.86,84.52 | R73.2 114.95,84.52 117.86,84.52 | R81.1 117.86,85.85 117.86,84.52
N$92
  Bottom 1.676: R81.2 121.54,70.23 | 121.54,70.23 122.43,69.34 IC4.3 | C55.1 121.67,70.23 121.54,70.23
N$102
  Bottom 1.676: 104.65,64.77 R10.1 104.78,71.2 104.93,71.35 | 104.75,72.9 C16.2 104.78,71.88 104.93,71.73 104.93,71.35 | R73.1 104.93,71.35
(copper drawn outside any net)
  shapes: Bottom area x409, Bottom circle x8

### Text on the board
Bottom: PRODUCTION V.4 | BEN PROVENZANO III | ProDesigns